# Altium schematic sheet Fire LED.SchDoc
size A; Organization: Smart Product Design Lab; Address1: 201 Thornton; Address2: Stanford University; Address3: Stanford, CA; Address4: 94305-4021
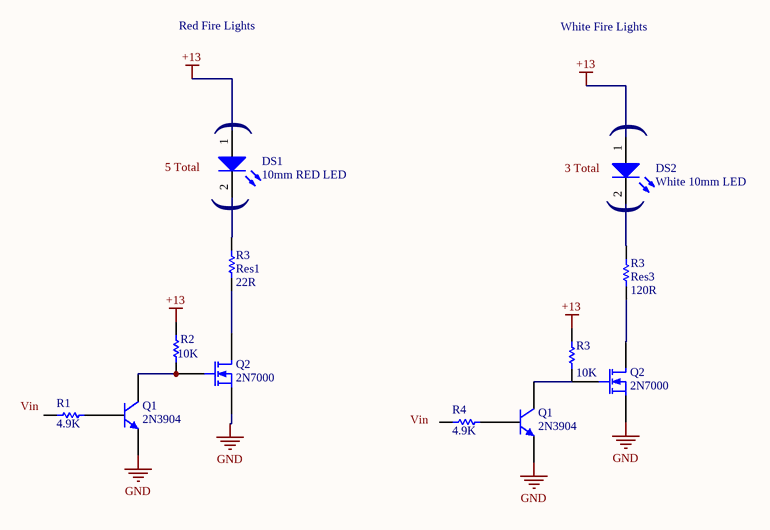
[diagram p0: Fire LED.SchDoc]

## Parts
(Parts that share a designator on the sheet are numbered #1, #2 ... from top to bottom, then left to right.)
DS1  10mm RED LED  [LED-1]
DS2  White 10mm LED  [LED-1]
Q1#1  2N3904  [BCY-W3/D4.7]
Q1#2  2N3904  [BCY-W3/D4.7]
Q2#1  2N7000  [BCY-W3/D5]
Q2#2  2N7000  [BCY-W3/D5]
R1  value 4.9K  [AXIAL-0.3]  (hidden comment: Res1)
R2  value 10K  [AXIAL-0.3]  (hidden comment: Res1)
R3#1  Res1  value 22R  [AXIAL-0.3]
R3#2  Res3  value 120R  [AXIAL-0.3]
R3#3  value 10K  [AXIAL-0.3]  (hidden comment: Res1)
R4  value 4.9K  [AXIAL-0.3]  (hidden comment: Res1)

## Nets
+13: DS1.1(A) DS2.1(A) R2.2 R3#3.2
GND: Q1#1.1(E) Q1#2.1(E) Q2#1.1(S)
NetDS1_2: DS1.2(K) R3#1.2
NetDS2_2: DS2.2(K) R3#2.2
NetQ1#1_2: Q1#1.2(B) R1.1
NetQ1#1_3: Q1#1.3(C) Q2#1.2(G) R2.1
NetQ1#2_2: Q1#2.2(B) R4.1
NetQ1#2_3: Q1#2.3(C) Q2#2.2(G)
NetQ2#1_3: Q2#1.3(D) R3#1.1
NetQ2#2_3: Q2#2.3(D) R3#2.1

Not connected (* = marked no-connect by the designer): Q2#2 1(S); R1 2; R3#3 1; R4 2

## Notes on the sheet
- Red Fire Lights
- White Fire Lights
- (near DS1) (
- (near DS2) (
- Labels drawn without touching a wire or pin: 3 Total, 5 Total, GND, Vin
- Title
- Size:
- Date:
- File:
- A
- Number:
- Time:
- Revision:
- Sheet
- of
- Drawn By:

## Library data of the parts
DS1 DS2 = LED1: Typical RED GaAs LED; Manufacturer: Generic Components; Class: Optoelectronic; Published: 08/06/2000; Publisher: Altium Hobart Technology Centre; SubClass: LED
Q1#1 Q1#2 = 2N3904: NPN General Purpose Amplifier; Manufacturer: Generic Components; Revised: 11-July-2000: SIM Model Added.; Class: Discrete; SubClass: BJT - Low Power; Published: 08/06/2000; Publisher: Altium Hobart Technology Centre
Q2#1 Q2#2 = 2N7000: N-Channel Enhancement Mode Vertical DMOS FET; Manufacturer: Zetex; Class: Discrete; SubClass: MOSFET - Low Power; Published: 8/06/2000; Publisher: Altium Hobart Technology Centre
R1 R2 R3#1-R3#3 R4 = Res1: Resistor; Manufacturer: Generic Components; Class: Passive; Published: 08/06/2000; Publisher: Altium Hobart Technology Centre; SubClass: Resistor